# EAGLE schematic power_board (EAGLE 9.6.2)
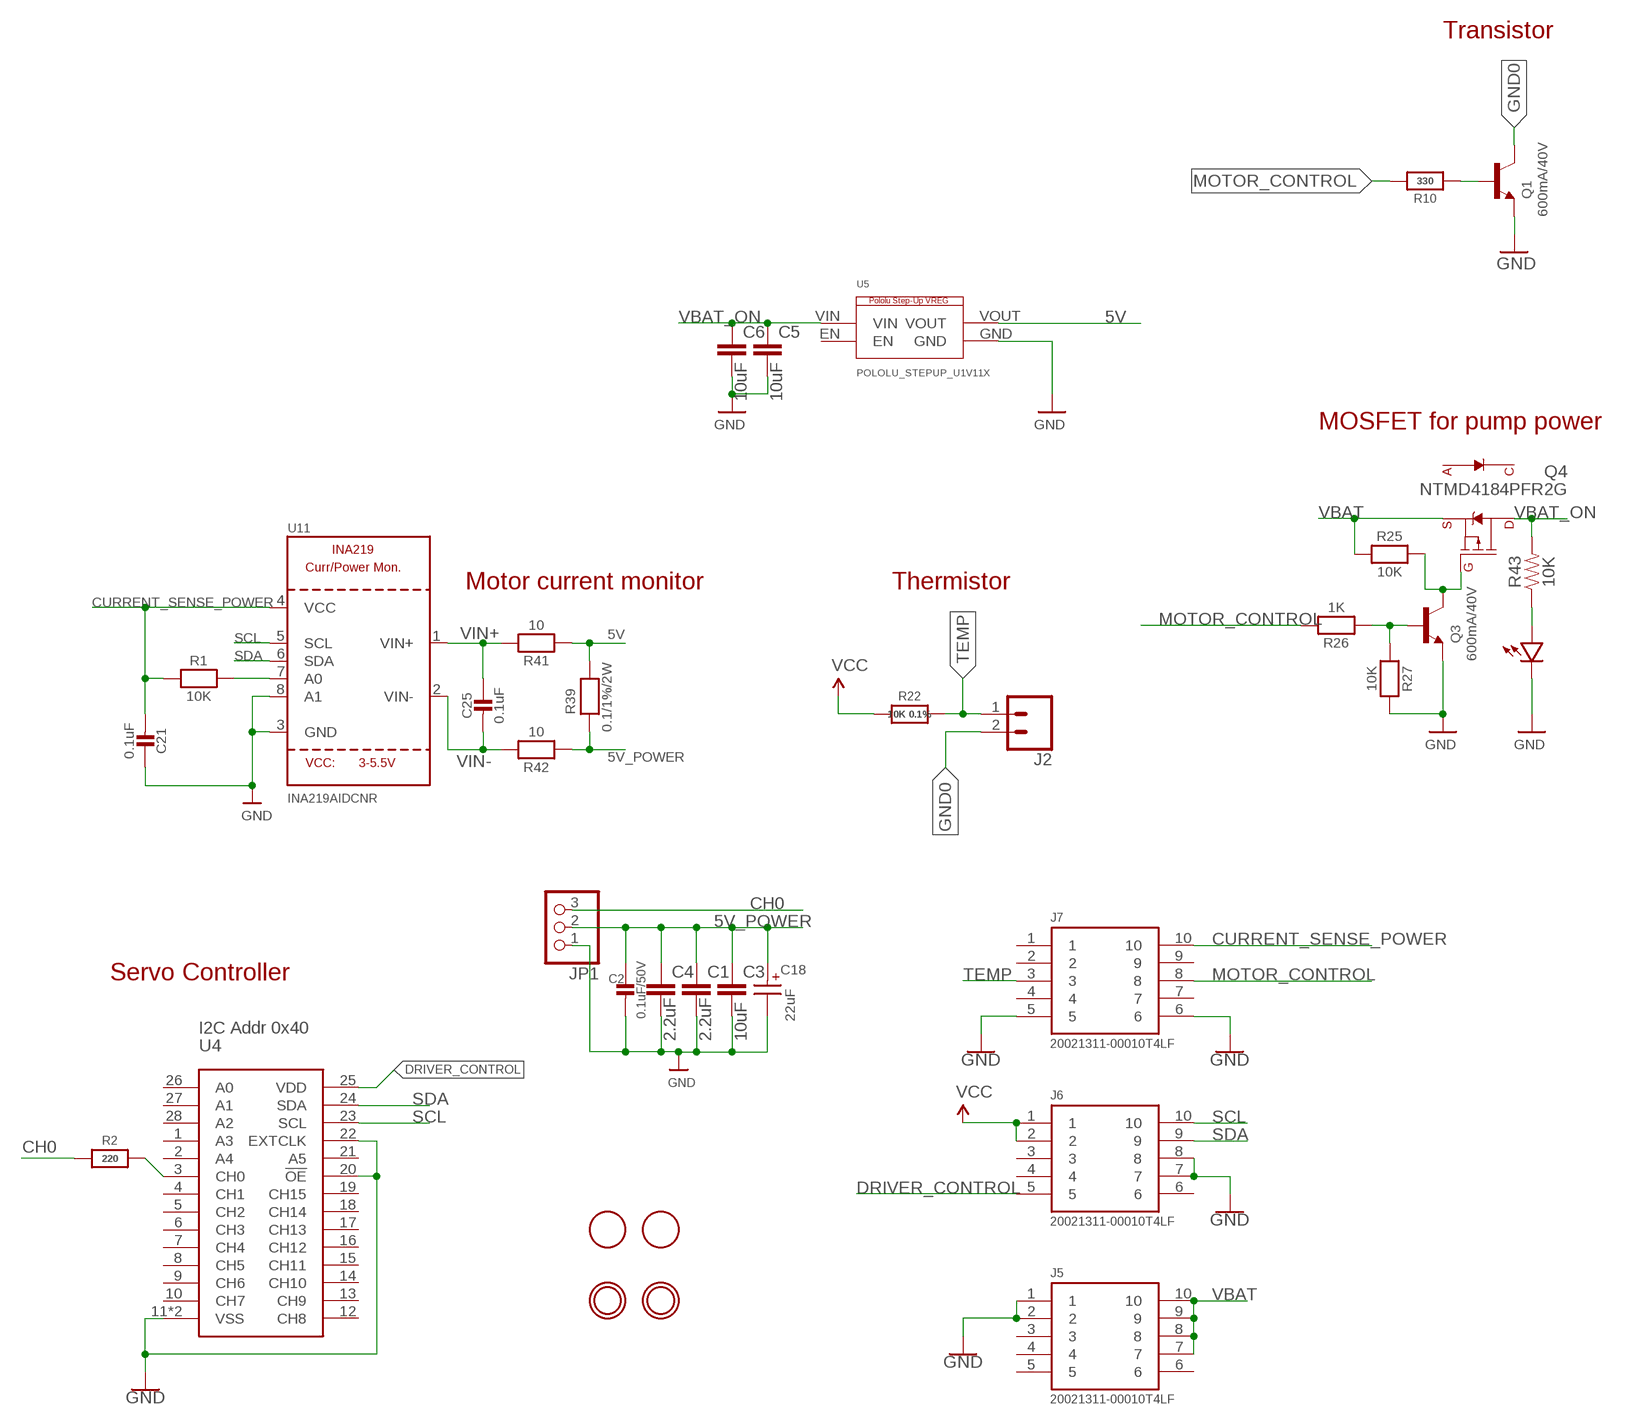
[diagram p0: schematic, sheet 1]

## Parts
C1  2.2uF  CAP1206  [1206]
C2  0.1uF/50V  CAP_CERAMIC0805-NOOUTLINE  [0805-NO]
C3  10uF  CAP0805  [0805]
C4  2.2uF  CAP1206  [1206]
C5  10uF  CAP1206  [1206]
C6  10uF  CAP1206  [1206]
C18  22uF  WCAP-ATLL_5X11_860160672011  [WCAP-ATLL_5X11(DXL)]
C21  0.1uF  MICROBUILDER_CAP_CERAMIC_0402MP  [MICROBUILDER__0402MP]
C25  0.1uF  MICROBUILDER_CAP_CERAMIC_0402MP  [MICROBUILDER__0402MP]
J2  CONN_02  [1X02]
J5  20021311-00010T4LF  [HEADER_1.27MM_2X5]
J6  20021311-00010T4LF  [HEADER_1.27MM_2X5]
J7  20021311-00010T4LF  [HEADER_1.27MM_2X5]
JP1  PINHD-1X3  [1X03]
LED1  BLUE  LED0805  [0805-LED]
Q1  600mA/40V  TRANS_NPN-MMBT2222AL  [SOT23-3]
Q3  600mA/40V  TRANS_NPN-MMBT2222AL  [SOT23-3]
Q4  NTMD4184PFR2G  [SOIC-8]
R1  10K  MICROBUILDER_RESISTOR_0402MP  [MICROBUILDER__0402MP]
R2  220  MICROBUILDER_RESISTOR_0402MP  [MICROBUILDER__0402MP]
R10  330  MICROBUILDER_RESISTOR_0402MP  [MICROBUILDER__0402MP]
R22  10K 0.1%  MICROBUILDER_RESISTOR_0402MP  [MICROBUILDER__0402MP]
R25  10K  MICROBUILDER_RESISTOR_0402MP  [MICROBUILDER__0402MP]
R26  1K  MICROBUILDER_RESISTOR_0402MP  [MICROBUILDER__0402MP]
R27  10K  MICROBUILDER_RESISTOR_0402MP  [MICROBUILDER__0402MP]
R39  0.1/1%/2W  RESISTOR2512  [2512]
R41  10  MICROBUILDER_RESISTOR_0402MP  [MICROBUILDER__0402MP]
R42  10  MICROBUILDER_RESISTOR_0402MP  [MICROBUILDER__0402MP]
R43  10K  RESISTOR0805  [0805]
U4  PCA9685HVQFN28  [HVQFN28_SOT788-1]
U5  POLOLU_STEPUP_U1V11X  [POLOLU_STEPUP_U1V11X]
U11  INA219AIDCNR  INA219  [SOT23-8]
U$2  MOUNTINGHOLE2.5  [MOUNTINGHOLE_2.5_PLATED]
U$3  MOUNTINGHOLE2.5  [MOUNTINGHOLE_2.5_PLATED]
U$8  FIDUCIAL  [FIDUCIAL_1MM]
U$9  FIDUCIAL  [FIDUCIAL_1MM]

## Nets
5V: R39.2 R41.1 U5.VOUT
5V_POWER: C1.1 C2.1 C3.1 C4.1 C18.1(+) JP1.2 R39.1 R42.1
CH0: JP1.3 R2.1
CURRENT_SENSE_POWER: C21.2 J7.10 R1.1 U11.4(VCC)
DRIVER_CONTROL: J6.5 U4.25(VDD)
GND [power]: C1.2 C2.2 C3.2 C4.2 C5.2 C6.2 C18.2(-) C21.1 J5.1 J5.2 J6.7 J6.8 J7.5 J7.6 JP1.1 LED1.MINUS Q1.2(E) Q3.2(E) R27.2 U4.11(VSS) U4.20(!OE) U4.22(EXTCLK) U4.TH(VSS) U5.GND U11.3(GND) U11.8(A1)
GND0: J2.2 Q1.3(C)
MOTOR_CONTROL: J7.8 R10.2 R26.2
N$1 [power]: R1.2 U11.7(A0)
N$7: Q1.1(B) R10.1
N$9: R2.2 U4.3(CH0)
N$11: LED1.PLUS R43.1
N$32: Q3.3(C) Q4.4(G) R25.2
N$33: Q3.1(B) R26.1 R27.1
SCL: J6.10 U4.23(SCL) U11.5(SCL)
SDA: J6.9 U4.24(SDA) U11.6(SDA)
TEMP: J2.1 J7.3 R22.2
VBAT: J5.7 J5.8 J5.9 J5.10 Q4.3(S) R25.1
VBAT_ON [power]: C5.1 C6.1 Q4.5(D) Q4.6(D) R43.2 U5.VIN
VCC: J6.1 J6.2 R22.1
VIN+: C25.1 R41.2 U11.1(VIN+)
VIN-: C25.2 R42.2 U11.2(VIN-)
Unconnected: J5.3 J5.4 J5.5 J5.6 J6.3 J6.4 J6.6 J7.1 J7.2 J7.4 J7.7 J7.9 Q4.1(A) Q4.2(A) Q4.7(C) Q4.8(C) U4.1(A3) U4.2(A4) U4.4(CH1) U4.5(CH2) U4.6(CH3) U4.7(CH4) U4.8(CH5) U4.9(CH6) U4.10(CH7) U4.12(CH8) U4.13(CH9) U4.14(CH10) U4.15(CH11) U4.16(CH12) U4.17(CH13) U4.18(CH14) U4.19(CH15) U4.21(A5) U4.26(A0) U4.27(A1) U4.28(A2) U5.EN

## Notes on the sheet
- Transistor
- MOSFET for pump power
- Motor current monitor | Thermistor
- Servo Controller
- I2C Addr 0x40

## Library data of the parts
C1 C3-C6 = SparkFun-Passives:CAP: Capacitor Standard 0603 ceramic capacitor, and 0.1" leaded capacitor.
C2 = microbuilder:CAP_CERAMIC: Ceramic Capacitors For new designs, use the packages preceded by an '_' character since they are more reliable: The following footprints should be used on most boards: _0402 - Standard footprint for regular board layouts _0603 - Standard footprint for regular board layouts _0805 - Standard footprint for regular board layouts _1206 - Standard footprint for regular board layouts For extremely tight-pitch boards where space is at a premium, the following 'micro-pitch' footprints can be used (smaller pads, no silkscreen outline, etc.): _0402MP - Micro-pitch footprint for very dense/compact boards _0603MP - Micro-pitch footprint for very dense/compact boards _0805MP - Micro-pitch footprint for very dense/compact boards _1206MP - Micro-pitch footprint for very dense/compact boards
C18 = 860160672011_Eagle_WCAP-ATLL_rev20a:WCAP-ATLL_5X11: WCAP-ATLL Aluminum Electrolytic Capacitors Long Life +105 °C Characteristics Long life product series Mounting style: THT Radial Capacitance range: 0.47 µF ‒ 6800 µF Capacitance tolerance: ±20 % Voltage range (UR): 10 ‒ 50 V(DC) Operating temperature: -55 °C up to +105 °C Endurance: 3000 ‒ 10000 h @ +105 °C Dimensions (DxL) in mm: 5.0 x 11.0 up to 18.0 x 35.5 Recommended soldering: Wave soldering Applications Long life application Filtering Smoothing Energy storage Coupling e.g. Switched-mode power supply, AC/DC converter, adapter, charger, digital camera <https://www.we-online.com/catalog/media/o14730v209%20Family_WCAP-ATLL.jpg> Details see: https://www.we-online.com/catalog/en/WCAP-ATLL/ Updated by yingchun,Shan;2020-03-02 2020(C) Würth Elektronik; DATASHEET-URL: https://www.we-online.com/catalog/datasheet/860160672011.pdf; DF: 10%; DIAMETER: 5mm; I-LEAK: 11uA; I-RIPPLE: 162mA; L: 11mm; MPN: 860160672011; OPERATING-TEMPERATURE: -55 °C up to +105 °C; PART-NUMBER: 860160672011; PITCH: 2mm; TECHNICAL-REFERENCE: ATEC110220M050DSPA3C000; VALUE: 22 µF; VR: 50V(DC)
C21 C25 = Adafruit Feather 32u4 Bluefruit LE:MICROBUILDER_CAP_CERAMIC: Ceramic Capacitors For new designs, use the packages preceded by an '_' character since they are more reliable: The following footprints should be used on most boards: _0402 - Standard footprint for regular board layouts _0603 - Standard footprint for regular board layouts _0805 - Standard footprint for regular board layouts _1206 - Standard footprint for regular board layouts For extremely tight-pitch boards where space is at a premium, the following 'micro-pitch' footprints can be used (smaller pads, no silkscreen outline, etc.): _0402MP - Micro-pitch footprint for very dense/compact boards _0603MP - Micro-pitch footprint for very dense/compact boards _0805MP - Micro-pitch footprint for very dense/compact boards _1206MP - Micro-pitch footprint for very dense/compact boards; MPN: GRM155R71C104KA88J
J2 = SparkFun-Connectors:CONN_02: Multi connection point. Often used as Generic Header-pin footprint for 0.1 inch spaced/style header connections On any of the 0.1 inch spaced packages, you can populate with these: Break Away Headers - Straight <https://www.sparkfun.com/products/116> (PRT-00116) Break Away Male Headers - Right Angle <https://www.sparkfun.com/products/553> (PRT-00553) Female Headers <https://www.sparkfun.com/products/115> (PRT-00115) Break Away Headers - Machine Pin <https://www.sparkfun.com/products/117> (PRT-00117) Break Away Female Headers - Swiss Machine Pin <https://www.sparkfun.com/products/743> (PRT-00743) For SCREWTERMINALS and SPRING TERMINALS visit here: Screw Terimnals on SparkFun.com <https://www.sparkfun.com/search/results?term=Screw+Terminals> (5mm/3.5mm/2.54mm spacing) This device is also useful as a general connection point to wire up your design to another part of your project. Our various solder wires solder well into these plated through hole pads. Hook-Up Wire - Assortment (Stranded, 22 AWG) <https://www.sparkfun.com/products/11375> (PRT-11375) Hook-Up Wire - Assortment (Solid Core, 22 AWG) <https://www.sparkfun.com/products/11367> (PRT-11367) View the entire wire category on our website here <https://www.sparkfun.com/categories/141> Special notes: Molex polarized connector foot print use with: PRT-08233 with associated crimp pins and housings. 2.54_SCREWTERM for use with PRT-10571. 3.5mm Screw Terminal footprints for PRT-08084 5mm Screw Terminal footprints for use with PRT-08432
J5-J7 = Amphenol:20021311-00010T4LF
JP1 = adafruit:PINHD-1X3: PIN HEADER
LED1 = LowPowerLab:LED; MPN: 150080BS75000
Q1 Q3 = SparkFun-DiscreteSemi:TRANS_NPN: NPN transistor Current controlled devices typically used to amplify current or used as a switch. BC547 - COM-08928 <http://www.sparkfun.com/products/8928> (TO-92 45V 100mA) (1.Collector 2.Base 3.Emitter) 2N3904 - COM-00521 <http://www.sparkfun.com/products/521> (TO-92 40V 200mA) (1.Emitter 2.Base 3.Collector) P2N2222A - COM-12852 <http://www.sparkfun.com/products/12852> (TO-92 40V 600mA) (1.Collector 2.Base 3.Emitter); MPN: MMBT3904-TP; PROD_ID: TRANS-08049
Q4 = NTMD4184PFR2G:NTMD4184PFR2G: MOSFET – Power, Single, P-Channel, Schottky Diode, Schottky Barrier Diode -30 V, -4.0 A, 20 V, 2.2A MPN: NTMD4184PFR2G Designed by AKstudios github.com/akstudios; MPN: NTMD4184PFR2G
R1 R25 R27 = Adafruit Feather 32u4 Bluefruit LE:MICROBUILDER_RESISTOR: Resistors For new designs, use the packages preceded by an '_' character since they are more reliable: The following footprints should be used on most boards: _0402 - Standard footprint for regular board layouts _0603 - Standard footprint for regular board layouts _0805 - Standard footprint for regular board layouts _1206 - Standard footprint for regular board layouts For extremely tight-pitch boards where space is at a premium, the following 'micro-pitch' footprints can be used (smaller pads, no silkscreen outline, etc.): _0402MP - Micro-pitch footprint for very dense/compact boards _0603MP - Micro-pitch footprint for very dense/compact boards _0805MP - Micro-pitch footprint for very dense/compact boards _1206MP - Micro-pitch footprint for very dense/compact boards; MPN: RC0402FR-7W10KL
R2 = Adafruit Feather 32u4 Bluefruit LE:MICROBUILDER_RESISTOR: Resistors For new designs, use the packages preceded by an '_' character since they are more reliable: The following footprints should be used on most boards: _0402 - Standard footprint for regular board layouts _0603 - Standard footprint for regular board layouts _0805 - Standard footprint for regular board layouts _1206 - Standard footprint for regular board layouts For extremely tight-pitch boards where space is at a premium, the following 'micro-pitch' footprints can be used (smaller pads, no silkscreen outline, etc.): _0402MP - Micro-pitch footprint for very dense/compact boards _0603MP - Micro-pitch footprint for very dense/compact boards _0805MP - Micro-pitch footprint for very dense/compact boards _1206MP - Micro-pitch footprint for very dense/compact boards; MPN: RC0402JR-071KL
R10 = Adafruit Feather 32u4 Bluefruit LE:MICROBUILDER_RESISTOR: Resistors For new designs, use the packages preceded by an '_' character since they are more reliable: The following footprints should be used on most boards: _0402 - Standard footprint for regular board layouts _0603 - Standard footprint for regular board layouts _0805 - Standard footprint for regular board layouts _1206 - Standard footprint for regular board layouts For extremely tight-pitch boards where space is at a premium, the following 'micro-pitch' footprints can be used (smaller pads, no silkscreen outline, etc.): _0402MP - Micro-pitch footprint for very dense/compact boards _0603MP - Micro-pitch footprint for very dense/compact boards _0805MP - Micro-pitch footprint for very dense/compact boards _1206MP - Micro-pitch footprint for very dense/compact boards; MPN: RC0402JR-0710KL
R22 = Adafruit Feather 32u4 Bluefruit LE:MICROBUILDER_RESISTOR: Resistors For new designs, use the packages preceded by an '_' character since they are more reliable: The following footprints should be used on most boards: _0402 - Standard footprint for regular board layouts _0603 - Standard footprint for regular board layouts _0805 - Standard footprint for regular board layouts _1206 - Standard footprint for regular board layouts For extremely tight-pitch boards where space is at a premium, the following 'micro-pitch' footprints can be used (smaller pads, no silkscreen outline, etc.): _0402MP - Micro-pitch footprint for very dense/compact boards _0603MP - Micro-pitch footprint for very dense/compact boards _0805MP - Micro-pitch footprint for very dense/compact boards _1206MP - Micro-pitch footprint for very dense/compact boards; MPN: RC0402JR-0727RL
R26 = Adafruit Feather 32u4 Bluefruit LE:MICROBUILDER_RESISTOR: Resistors For new designs, use the packages preceded by an '_' character since they are more reliable: The following footprints should be used on most boards: _0402 - Standard footprint for regular board layouts _0603 - Standard footprint for regular board layouts _0805 - Standard footprint for regular board layouts _1206 - Standard footprint for regular board layouts For extremely tight-pitch boards where space is at a premium, the following 'micro-pitch' footprints can be used (smaller pads, no silkscreen outline, etc.): _0402MP - Micro-pitch footprint for very dense/compact boards _0603MP - Micro-pitch footprint for very dense/compact boards _0805MP - Micro-pitch footprint for very dense/compact boards _1206MP - Micro-pitch footprint for very dense/compact boards; MPN: RC0402FR-101KL
R39 = microbuilder:RESISTOR: Resistors 0402 - 0402 Surface Mount Package 22 Ohm 1% 1/16W [Digikey: 311-22.0LRTR-ND] 33 Ohm 5% 1/16W 1.0K 5% 1/16W 1.5K 5% 1/16W 2.0K 1% 1/16W 10.0K 1% 1/16W [Digikey: 311-10.0KLRTR-ND] 10.0K 5% 1/16W [Digikey: RMCF0402JT10K0TR-ND] 12.1K 1% 1/16W [Digikey: 311-22.0LRTR-ND] 100.0K 5% 1/16W 0603 - 0603 Surface Mount Package 0 Ohm 1/10 Watt 1% Resistor 15 Ohm 1/10 Watt 1% Resistor 33 Ohm 1/10 Watt 1% Resistor 49.9 Ohm 1/10 Watt 1% Resistor 100 Ohm 1/10 Watt 1% Resistor 150 Ohm 1/10 Watt 1% Resistor 240 Ohm 1/10 Watt 1% Resistor 390 Ohm 1/10 Watt 1% Resistor 560 Ohm 1/10 Watt 1% Resistor 680 Ohm 1/10 Watt 1% Resistor 750 Ohm 1/10 Watt 1% Resistor 1.0K Ohm 1/10 Watt 1% Resistor 1.5K Ohm 1/10 Watt 1% Resistor 2.0K Ohm 1/10 Watt 1% Resistor 2.2K Ohm 1/10 Watt 1% Resistor 3.3K Ohm 1/10 Watt 1% Resistor 4.7K Ohm 1/10 Watt 1% Resistor 10.0K Ohm 1/10 Watt 1% Resistor 12.0K Ohm 1/10 Watt 1% Resistor 12.1K Ohm 1/10 Watt 1% Resistor 20.0K Ohm 1/10 Watt 1% Resistor 33.0K Ohm 1/10 Watt 1% Resistor 100.0K Ohm 1/10 Watt 1% Resistor 0805 - 0805 Surface Mount Package 0 Ohm 1/8 Watt 1% Resistor 33 Ohm 1/8 Watt 1% Resistor 100 Ohm 1/8 Watt 1% Resistor 150 Ohm 1/8 Watt 1% Resistor 200 Ohm 1/8 Watt 1% Resistor 240 Ohm 1/8 Watt 1% Resistor 330 Ohm 1/8 Watt 1% Resistor 390 Ohm 1/8 Watt 1% Resistor 470 Ohm 1/8 Watt 1% Resistor 1.0K Ohm 1/8 Watt 1% Resistor 1.5K Ohm 1/8 Watt 1% Resistor 2.0K Ohm 1/8 Watt 1% Resistor 4.7K Ohm 1/8 Watt 1% Resistor 5.1K Ohm 1/8 Watt 1% Resistor 5.6K Ohm 1/8 Watt 1% Resistor 10.0K Ohm 1/8 Watt 1% Resistor 22.0K Ohm 1/8 Watt 1% Resistor 33.0K Ohm 1/8 Watt 1% Resistor 100K Ohm 1/8 Watt 1% Resistor 1206 - 1206 Surface Mount Package 2012 - 2010 Surface Mount Package 0.11 Ohm 1/2 Watt 1% Resistor - Digikey: RHM.11UCT-ND; MPN: RCWE2512R100FKEA
R41 R42 = Adafruit Feather 32u4 Bluefruit LE:MICROBUILDER_RESISTOR: Resistors For new designs, use the packages preceded by an '_' character since they are more reliable: The following footprints should be used on most boards: _0402 - Standard footprint for regular board layouts _0603 - Standard footprint for regular board layouts _0805 - Standard footprint for regular board layouts _1206 - Standard footprint for regular board layouts For extremely tight-pitch boards where space is at a premium, the following 'micro-pitch' footprints can be used (smaller pads, no silkscreen outline, etc.): _0402MP - Micro-pitch footprint for very dense/compact boards _0603MP - Micro-pitch footprint for very dense/compact boards _0805MP - Micro-pitch footprint for very dense/compact boards _1206MP - Micro-pitch footprint for very dense/compact boards; MPN: RC0402FR-0710RL
R43 = SparkFun-Resistors:RESISTOR: Generic Resistor Package; MPN: RK73B2ATTD103J
U4 = PCA9685:PCA9685: 16-channel 12-bit PWM I2C interface Internal Oscillator 40Hz to 1kHz Can be totem pole or open collector 2.3V to 5.5V SparkFun Products SparkFun Block for Intel® Edison - PWM <https://www.sparkfun.com/products/13042> (DEV-13042) PROTO: IC-12240 PROD_ID: IC-12271
U5 = Pololu Step Up Vregs:POLOLU_STEPUP_U1V11X
U11 = microbuilder:INA219: INA219 - I2C Current/Power Monitor Voltage Range: 0-26V Accuracy: 0.5% Temperature: -40°C - 125°C; MPN: INA219AIDCNR
U$2 U$3 = ADS1x15:MOUNTINGHOLE: Mounting Hole For #2 screws (0.086"/2.18mm width, 0.094"/2.4mm hole) use 2.5mm
U$8 U$9 = adafruit:FIDUCIAL: For use by pick and place machines to calibrate the vision/machine, 1mm By microbuilder.eu

## Net classes
0 default: width 0.152 mm, drill 0.305 mm, clearance 0.152 mm
1 power: width 0.381 mm, clearance 0.254 mm